# EAGLE design sensor-test (EAGLE 7.7.0)
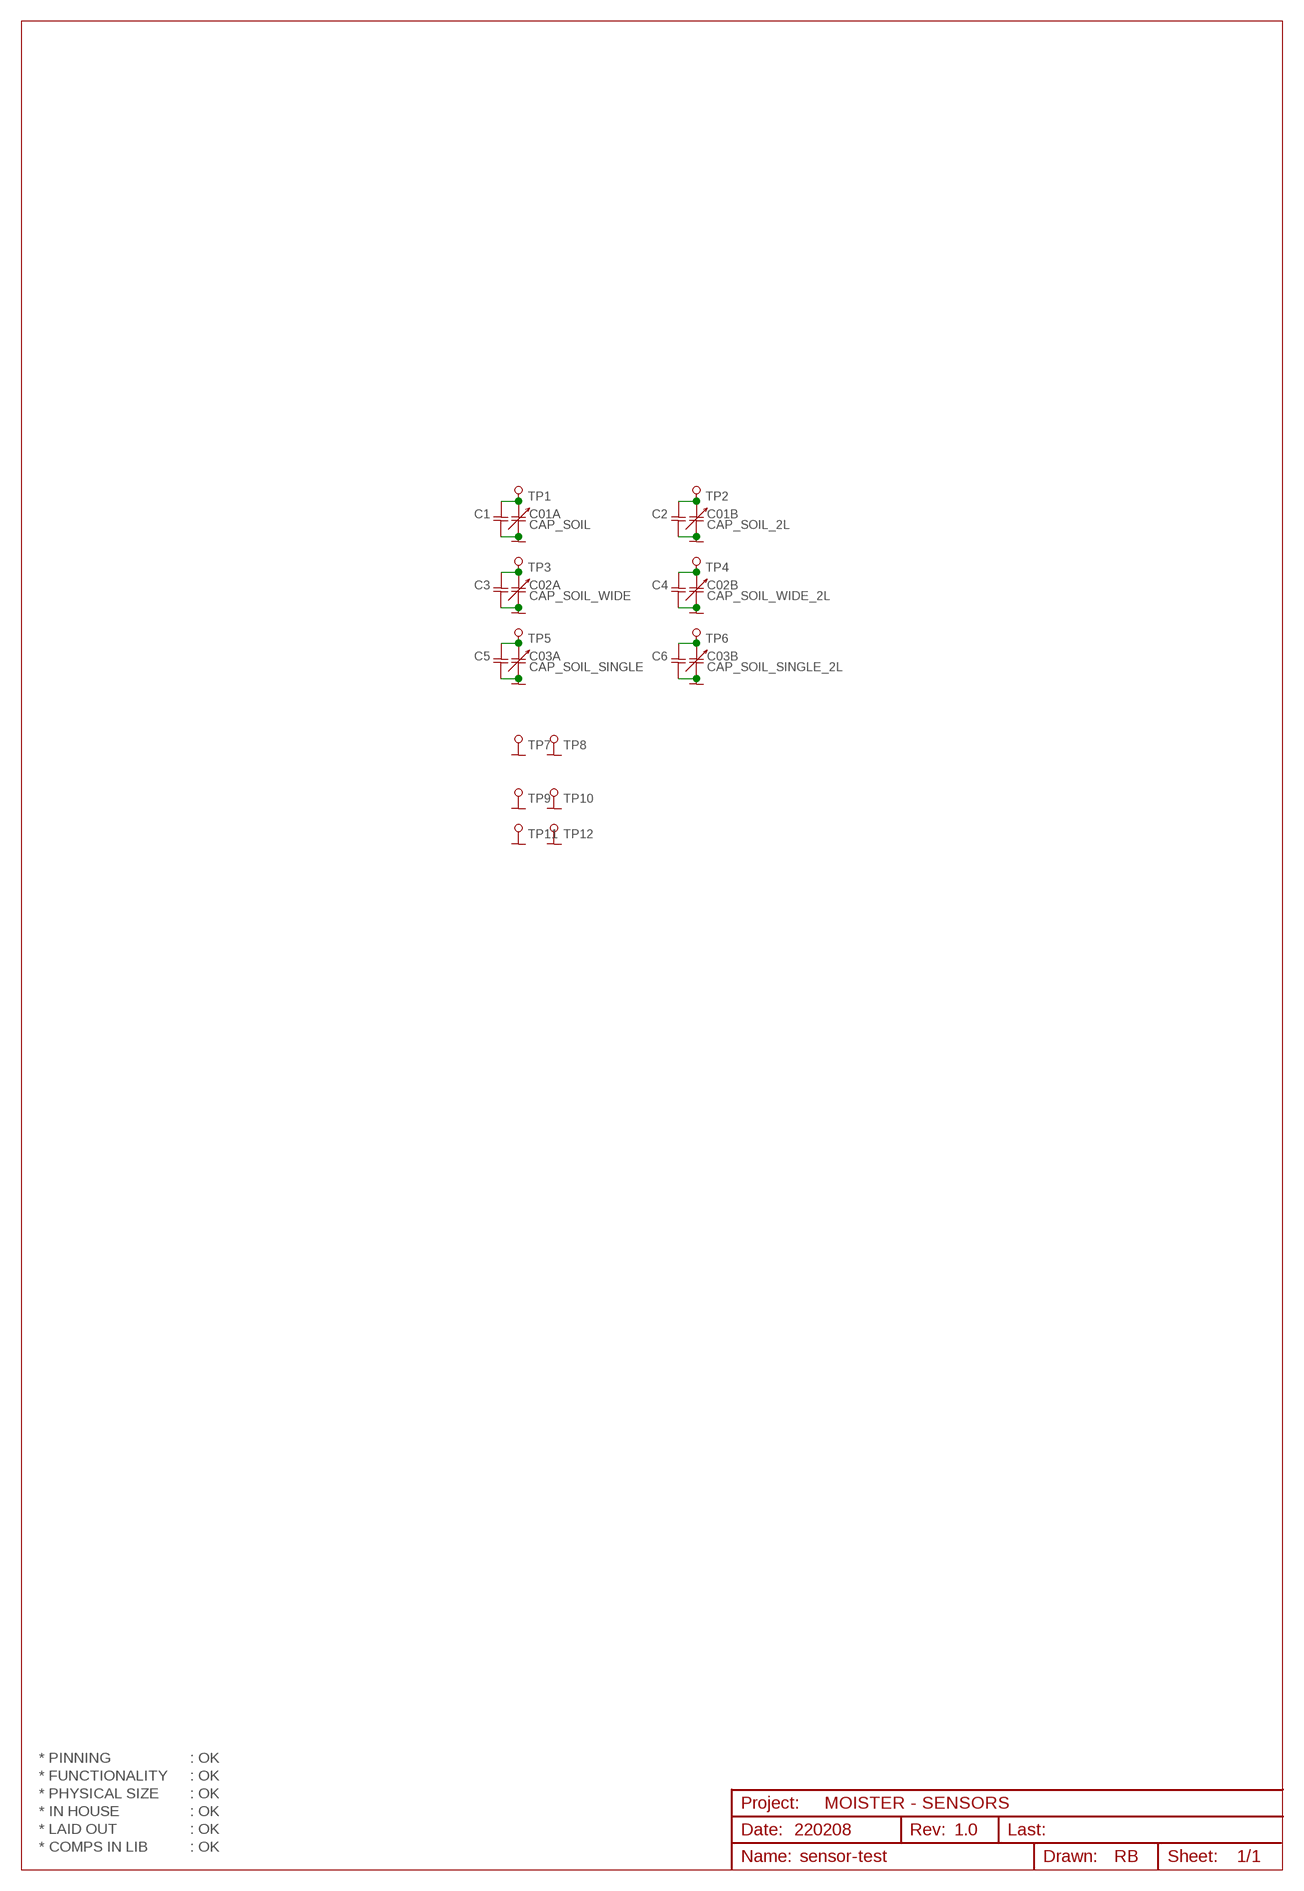
[diagram p0: schematic, sheet 1]

## Parts
C1  CAP0805  [CAP0805]
C01A  CAP_SOIL  [CAP_SOIL]
C01B  CAP_SOIL_2L  CAP_SOIL_2LAYER  [CAP_SOIL_2LAYER]
C2  CAP0805  [CAP0805]
C02A  CAP_SOIL_WIDE  [CAP_SOIL_WIDE]
C02B  CAP_SOIL_WIDE_2L  CAP_SOIL_WIDE_2LAYER  [CAP_SOIL_WIDE_2LAYER]
C3  CAP0805  [CAP0805]
C03A  CAP_SOIL_SINGLE  [CAP_SOIL_SINGLE]
C03B  CAP_SOIL_SINGLE_2L  CAP_SOIL_SINGLE_2LAYER  [CAP_SOIL_SINGLE_2LAYER]
C4  CAP0805  [CAP0805]
C5  CAP0805  [CAP0805]
C6  CAP0805  [CAP0805]
TP1  PIN_TEST  [HOLE_PTH_0.8MM]
TP2  PIN_TEST  [HOLE_PTH_0.8MM]
TP3  PIN_TEST  [HOLE_PTH_0.8MM]
TP4  PIN_TEST  [HOLE_PTH_0.8MM]
TP5  PIN_TEST  [HOLE_PTH_0.8MM]
TP6  PIN_TEST  [HOLE_PTH_0.8MM]
TP7  PIN_TEST  [HOLE_PTH_0.8MM]
TP8  PIN_TEST  [HOLE_PTH_0.8MM]
TP9  PIN_TEST  [HOLE_PTH_0.8MM]
TP10  PIN_TEST  [HOLE_PTH_0.8MM]
TP11  PIN_TEST  [HOLE_PTH_0.8MM]
TP12  PIN_TEST  [HOLE_PTH_0.8MM]

## Nets
GND: C1.2 C01A.2 C01B.2 C01B.P$1 C2.2 C02A.2 C02B.2 C02B.P$1 C3.2 C03A.2 C03B.2 C4.2 C5.2 C6.2 TP7.1 TP8.1 TP9.1 TP10.1 TP11.1 TP12.1
N$1: C1.1 C01A.1 TP1.1
N$8: C01B.1 C2.1 TP2.1
N$9: C02A.1 C3.1 TP3.1
N$10: C02B.1 C4.1 TP4.1
N$11: C03A.1 C5.1 TP5.1
N$12: C03B.1 C6.1 TP6.1

## Notes on the sheet
- * PINNING | : OK
- * FUNCTIONALITY | : OK
- * PHYSICAL SIZE | : OK
- MOISTER - SENSORS
- * IN HOUSE | : OK
- * LAID OUT | : OK | 220208 | 1.0
- * COMPS IN LIB | : OK

## Library data of the parts
C1-C6 = 00-own_parts:CAP0805: Capacitor, ceramic, 0805
C01A = 00-own_parts:CAP_SOIL: Capacitor, soil moisture sensor,bi-layer
C01B = 00-own_parts:CAP_SOIL_2LAYER: Capacitor, soil moisture sensor,bi-layer
C02A = 00-own_parts:CAP_SOIL_WIDE: Capacitor, soil moisture sensor
C02B = 00-own_parts:CAP_SOIL_WIDE_2LAYER: Capacitor, soil moisture sensor, bi-layer
C03A = 00-own_parts:CAP_SOIL_SINGLE: Capacitor, soil moisture sensor
C03B = 00-own_parts:CAP_SOIL_SINGLE_2LAYER: Capacitor, soil moisture senso, bi-layer
TP1-TP12 = 00-own_parts:PIN_TEST: Pin, test pad, hole 0.8mm, pad 1.6mm

## Board
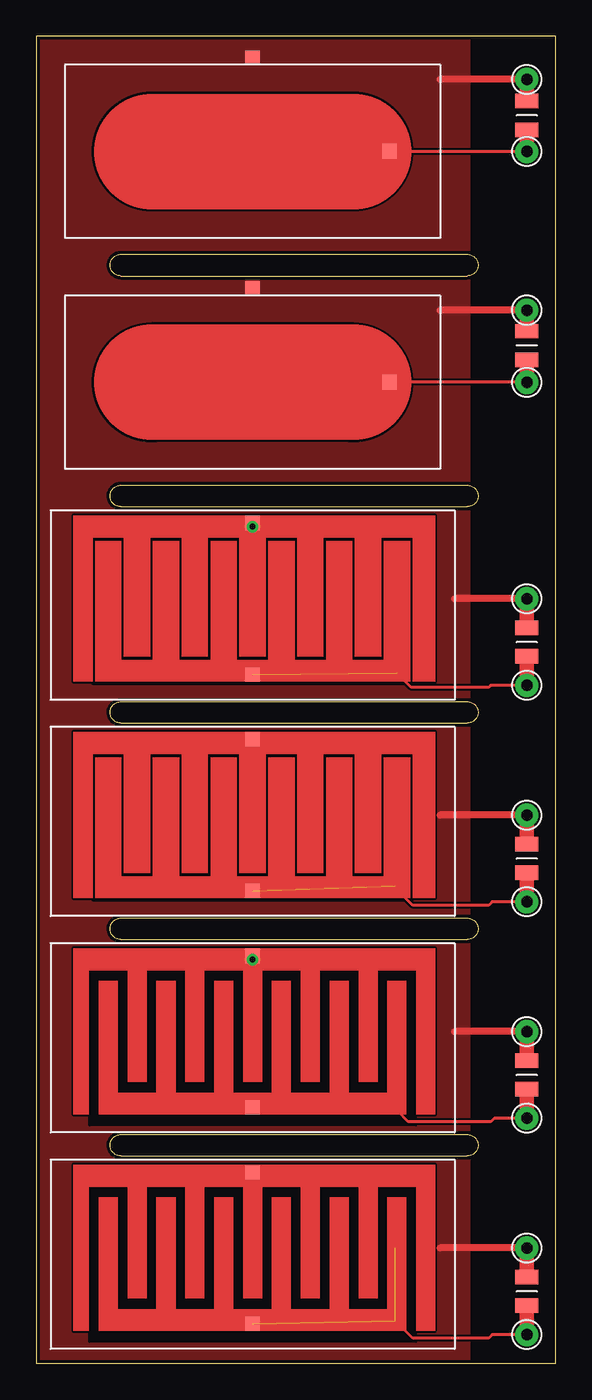
[diagram p1: board, top side]
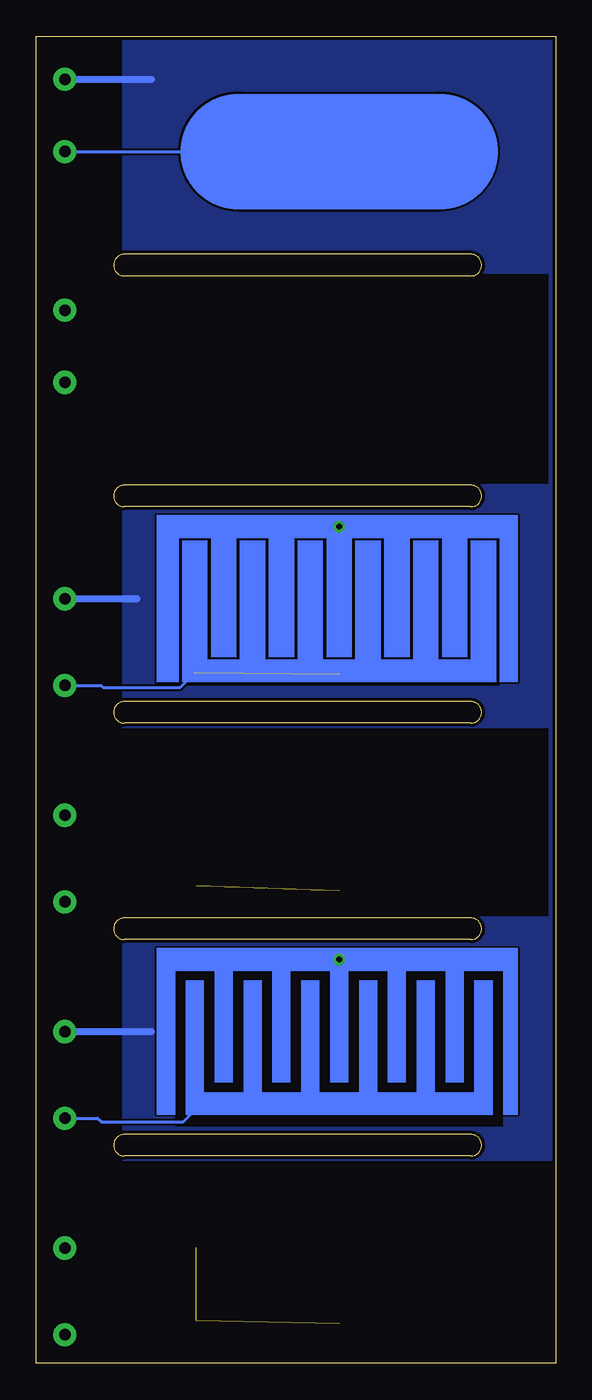
[diagram p2: board, bottom side, seen from below]

Size 36 x 92 mm. Coordinates in mm from the lower left corner, seen from the top.
Outline: 36,0 36,92 0,92 0,0 36,0
Outline: 5.88,15.88 29.88,15.88 arc-180 29.88,14.38 5.88,14.38 arc-180 5.88,15.88
Outline: 5.88,30.88 29.88,30.88 arc-180 29.88,29.38 5.88,29.38 arc-180 5.88,30.88
Outline: 5.88,45.88 29.88,45.88 arc-180 29.88,44.38 5.88,44.38 arc-180 5.88,45.88
Outline: 5.88,60.88 29.88,60.88 arc-180 29.88,59.38 5.88,59.38 arc-180 5.88,60.88
Outline: 5.88,76.88 29.88,76.88 arc-180 29.88,75.38 5.88,75.38 arc-180 5.88,76.88
Copper layers (1*2*15*16): Top 0.018mm / dielectric 0.36mm / layer 2 0.035mm / dielectric 0.71mm / layer 15 0.035mm / dielectric 0.36mm / Bottom 0.018mm
Design rules "eC-STANDARD_pool-4-layer-rb": minimum track width 0.15mm, minimum drill 0.15mm, track to track 0.15mm, track to pad 0.15mm, pad to pad 0.15mm, via to via 0.15mm, smd to smd 0mil, copper to edge 0.25mm, drill to drill 0.3mm, minimum pad ring 0.2mm, minimum via ring 0.125mm, stop-mask expansion 0.1mm, vias tented up to drill 0mil, thermal gap 0.2mm

### Footprints (pad centres in the part's own frame; a part is rotated, then mirrored left to right if it is on the bottom)
CAP0805 = smd 1 x 1.6: 1 -1,0; 2 1,0
CAP_SOIL = smd 1 x 1: 1 0,-5.25; 2 0,5.25
CAP_SOIL_2LAYER = smd 1 x 1: 1 0,-5.25; 2 0,5.25 | drill 0.4: P$1 0,5
CAP_SOIL_WIDE = smd 1 x 1: 1 0,-5.25; 2 0,5.25
CAP_SOIL_WIDE_2LAYER = smd 1 x 1: 1 0,-5.25; 2 0,5.25 | drill 0.4: P$1 0,5
CAP_SOIL_SINGLE = smd 1 x 1: 1 9.5,0; 2 0,6.5
CAP_SOIL_SINGLE_2LAYER = smd 1 x 1: 1 9.5,0; 2 0,6.5
HOLE_PTH_0.8MM = drill 0.8 pad 1.6: 1 0,0

### Placement (x,y rotation side)
C1  34,5 90 top
C01A  15,8 0 top
C01B  15,23 0 top
C2  34,20 90 top
C02A  15,38 0 top
C02B  15,53 0 top
C3  34,35 90 top
C03A  15,68 0 top
C03B  15,84 0 top
C4  34,50 90 top
C5  34,70.55 90 top
C6  34,86.5 90 top
TP1  34,2 0 top
TP2  34,17 0 top
TP3  34,32 0 top
TP4  34,47 0 top
TP5  34,68 0 top
TP6  34,84 0 top
TP7  34,8 0 top
TP8  34,23 0 top
TP9  34,38 0 top
TP10  34,53 0 top
TP11  34,73 0 top
TP12  34,89 0 top

### Tracks (layer width: path | path; a pad name or v marks a point on that pad's centre or on a via)
GND
  Top 0.5: TP12.1 28,89 | TP7.1 28,8 | TP8.1 29,23 | TP9.1 28,38 | TP10.1 29,53 | TP11.1 28,73
  Top 1: C1.2 TP7.1 | C2.2 TP8.1 | C4.2 TP10.1 | C5.2 TP11.1 | C6.2 TP12.1 | C3.2 TP9.1
  Bottom 0.5: TP12.1 28,89 | TP10.1 29,53 | TP8.1 28,23
  pour Top (no thermals): 0,0 0,92 30,92 30,0
  pour Bottom (no thermals): 0,0 0,92 30,92 30,0
N$1  (2 unrouted)
  Top 0.2: 24.9,8 24.9,8.05 | TP1.1 31.6,2 31.35,1.75 26.1,1.75 24.9,2.95
  Top 1: C1.1 TP1.1
N$2
  Top 0.2: 25.05,23 25.05,22.9
N$3
  Top 0.2: 24.9,38 24.9,37.9
N$7
  cutout Bottom: 0.5,75.5 0.5,61 30,61 30,75.5
  cutout Bottom: 0.5,44 0.5,31 30,31 30,44
  cutout Bottom: 0,14 0,0 30,0 30,14
N$8
  Top 0.2: 25,18 24.75,18 | 24.75,18 15.25,18 C01B.1 | TP2.1 31.75,17 31.5,16.75 25.8,16.75 25.05,17.5 25.05,17.7 24.75,18
  Top 1: C2.1 TP2.1
  Bottom 0.2: C01B.1 15.25,18 25,18 25.05,17.95 25.05,17.5 25.8,16.75 31.5,16.75 31.75,17 TP2.1
N$9  (1 unrouted)
  Top 0.2: TP3.1 31.6,32 31.35,31.75 26.1,31.75 25.05,32.8 25.05,32.95 24.9,33.1
  Top 1: C3.1 TP3.1
N$10  (1 unrouted)
  Top 0.2: 25.05,53 25.05,52.9 25,52.85 25,47.85 26,46.85 31.35,46.85 31.5,47 TP4.1
  Top 1: C4.1 TP4.1
  Bottom 0.2: TP4.1 31.5,47 31.35,46.85 26,46.85 25.2,47.65
N$11
  Top 0.2: TP5.1 C03A.1
  Top 1: C5.1 TP5.1
N$12
  Top 0.2: TP6.1 C03B.1
  Top 1: TP6.1 C6.1
  Bottom 0.2: TP6.1 23,84